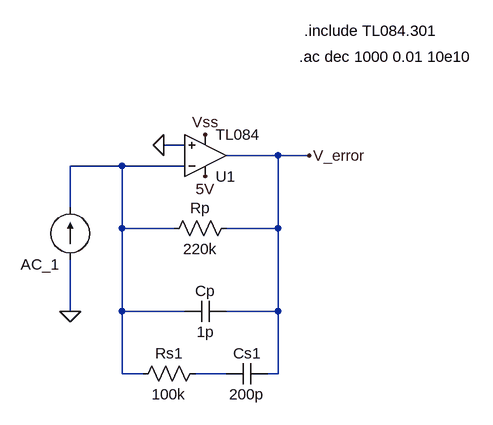
[diagram p0: schematic PID.asc]
PID.asc, the LTspice schematic file:
Version 4
SHEET 1 880 680
WIRE 240 240 208 240
WIRE 384 256 304 256
WIRE 432 256 384 256
WIRE 144 272 64 272
WIRE 240 272 144 272
WIRE 64 336 64 272
WIRE 144 368 144 272
WIRE 224 368 144 368
WIRE 384 368 384 256
WIRE 384 368 304 368
WIRE 64 496 64 416
WIRE 144 496 144 368
WIRE 240 496 144 496
WIRE 384 496 384 368
WIRE 384 496 304 496
WIRE 144 592 144 496
WIRE 176 592 144 592
WIRE 304 592 256 592
WIRE 384 592 384 496
WIRE 384 592 368 592
FLAG 432 256 V_error
FLAG 272 224 Vss
FLAG 272 288 5V
FLAG 208 240 0
FLAG 64 496 0
SYMBOL res 320 352 R90
WINDOW 0 0 56 VBottom 2
WINDOW 3 32 56 VTop 2
SYMATTR InstName Rp
SYMATTR Value 220k
SYMBOL cap 304 480 R90
WINDOW 0 0 32 VBottom 2
WINDOW 3 32 32 VTop 2
SYMATTR InstName Cp
SYMATTR Value 1p
SYMBOL opamp2 272 320 M180
SYMATTR InstName U1
SYMATTR Value TL084
SYMBOL current 64 416 R180
WINDOW 0 16 -8 Left 2
WINDOW 3 24 0 Left 2
SYMATTR InstName AC_1
SYMATTR Value ""
SYMATTR Value2 AC 1
SYMBOL res 272 576 R90
WINDOW 0 0 56 VBottom 2
WINDOW 3 32 56 VTop 2
SYMATTR InstName Rs1
SYMATTR Value 100k
SYMBOL cap 368 576 R90
WINDOW 0 0 32 VBottom 2
WINDOW 3 32 32 VTop 2
SYMATTR InstName Cs1
SYMATTR Value 200p
TEXT 416 104 Left 2 !.ac dec 1000 0.01 10e10
TEXT 424 64 Left 2 !.include TL084.301

The netlist it stands for:
* PID.asc
Rp V_error N001 220k
Cp V_error N001 1p
XU1 0 N001 5V Vss V_error TL084  ; pins In+ In- V+ V- OUT
I§AC_1 0 N001 AC 1
Rs1 N002 N001 100k
Cs1 V_error N002 200p
.ac dec 1000 0.01 10e10
.include TL084.301
.backanno
.end